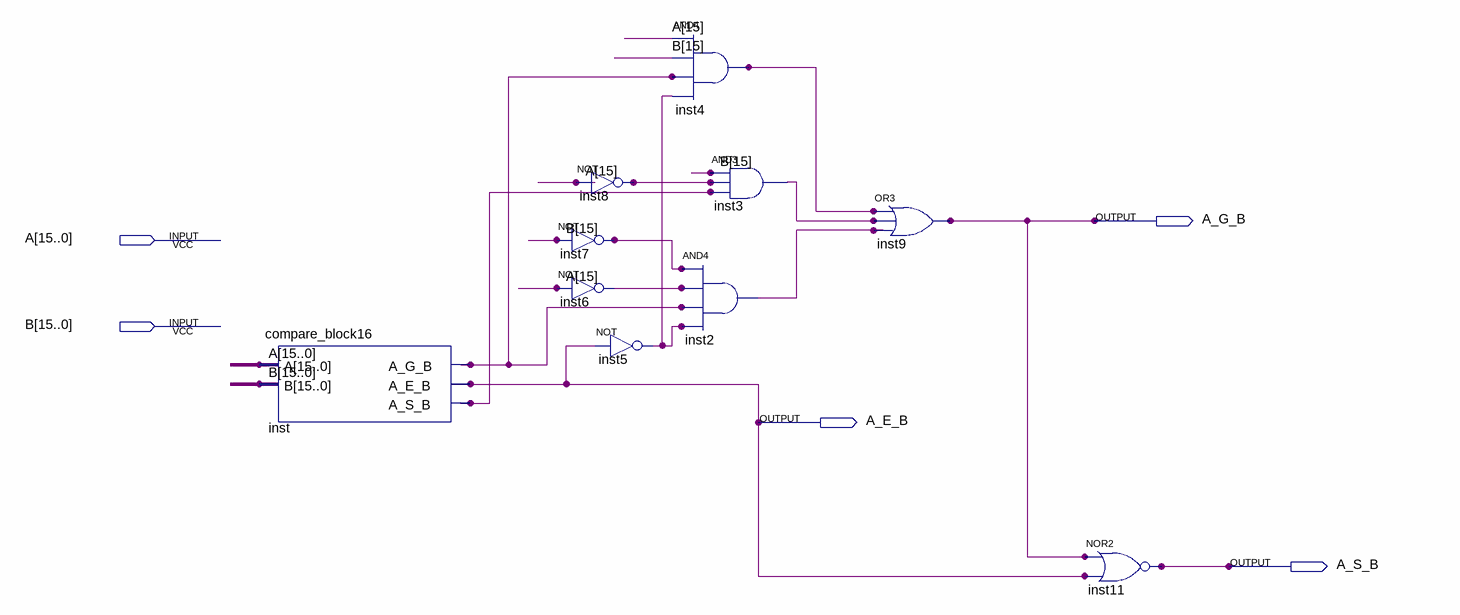
[diagram p0: schematic sheet]
// Quartus schematic signed_compare_block16.bdf as structural Verilog: 10 symbols, 5 pins
module signed_compare_block16 (
  input  [15:0] A,
  input  [15:0] B,
  output A_G_B,
  output A_E_B,
  output A_S_B
);

  wire inst2_out, inst3_out, inst4_out, inst5_out, inst6_out, inst7_out, inst8_out, inst_a_g_b, inst_a_s_b;

  compare_block16 inst (.A(A), .B(B), .A_G_B(inst_a_g_b), .A_E_B(A_E_B), .A_S_B(inst_a_s_b));
  not inst8 (inst8_out, A[15]);
  not inst7 (inst7_out, B[15]);
  not inst6 (inst6_out, A[15]);
  not inst5 (inst5_out, A_E_B);
  and inst4 (inst4_out, A[15], B[15], inst_a_g_b, inst5_out);
  and inst2 (inst2_out, inst7_out, inst6_out, inst_a_g_b, inst5_out);
  and inst3 (inst3_out, B[15], inst8_out, inst_a_s_b);
  or inst9 (A_G_B, inst4_out, inst3_out, inst2_out);
  nor inst11 (A_S_B, A_G_B, A_E_B);
endmodule
